# EAGLE design DressCode (EAGLE 6.4)
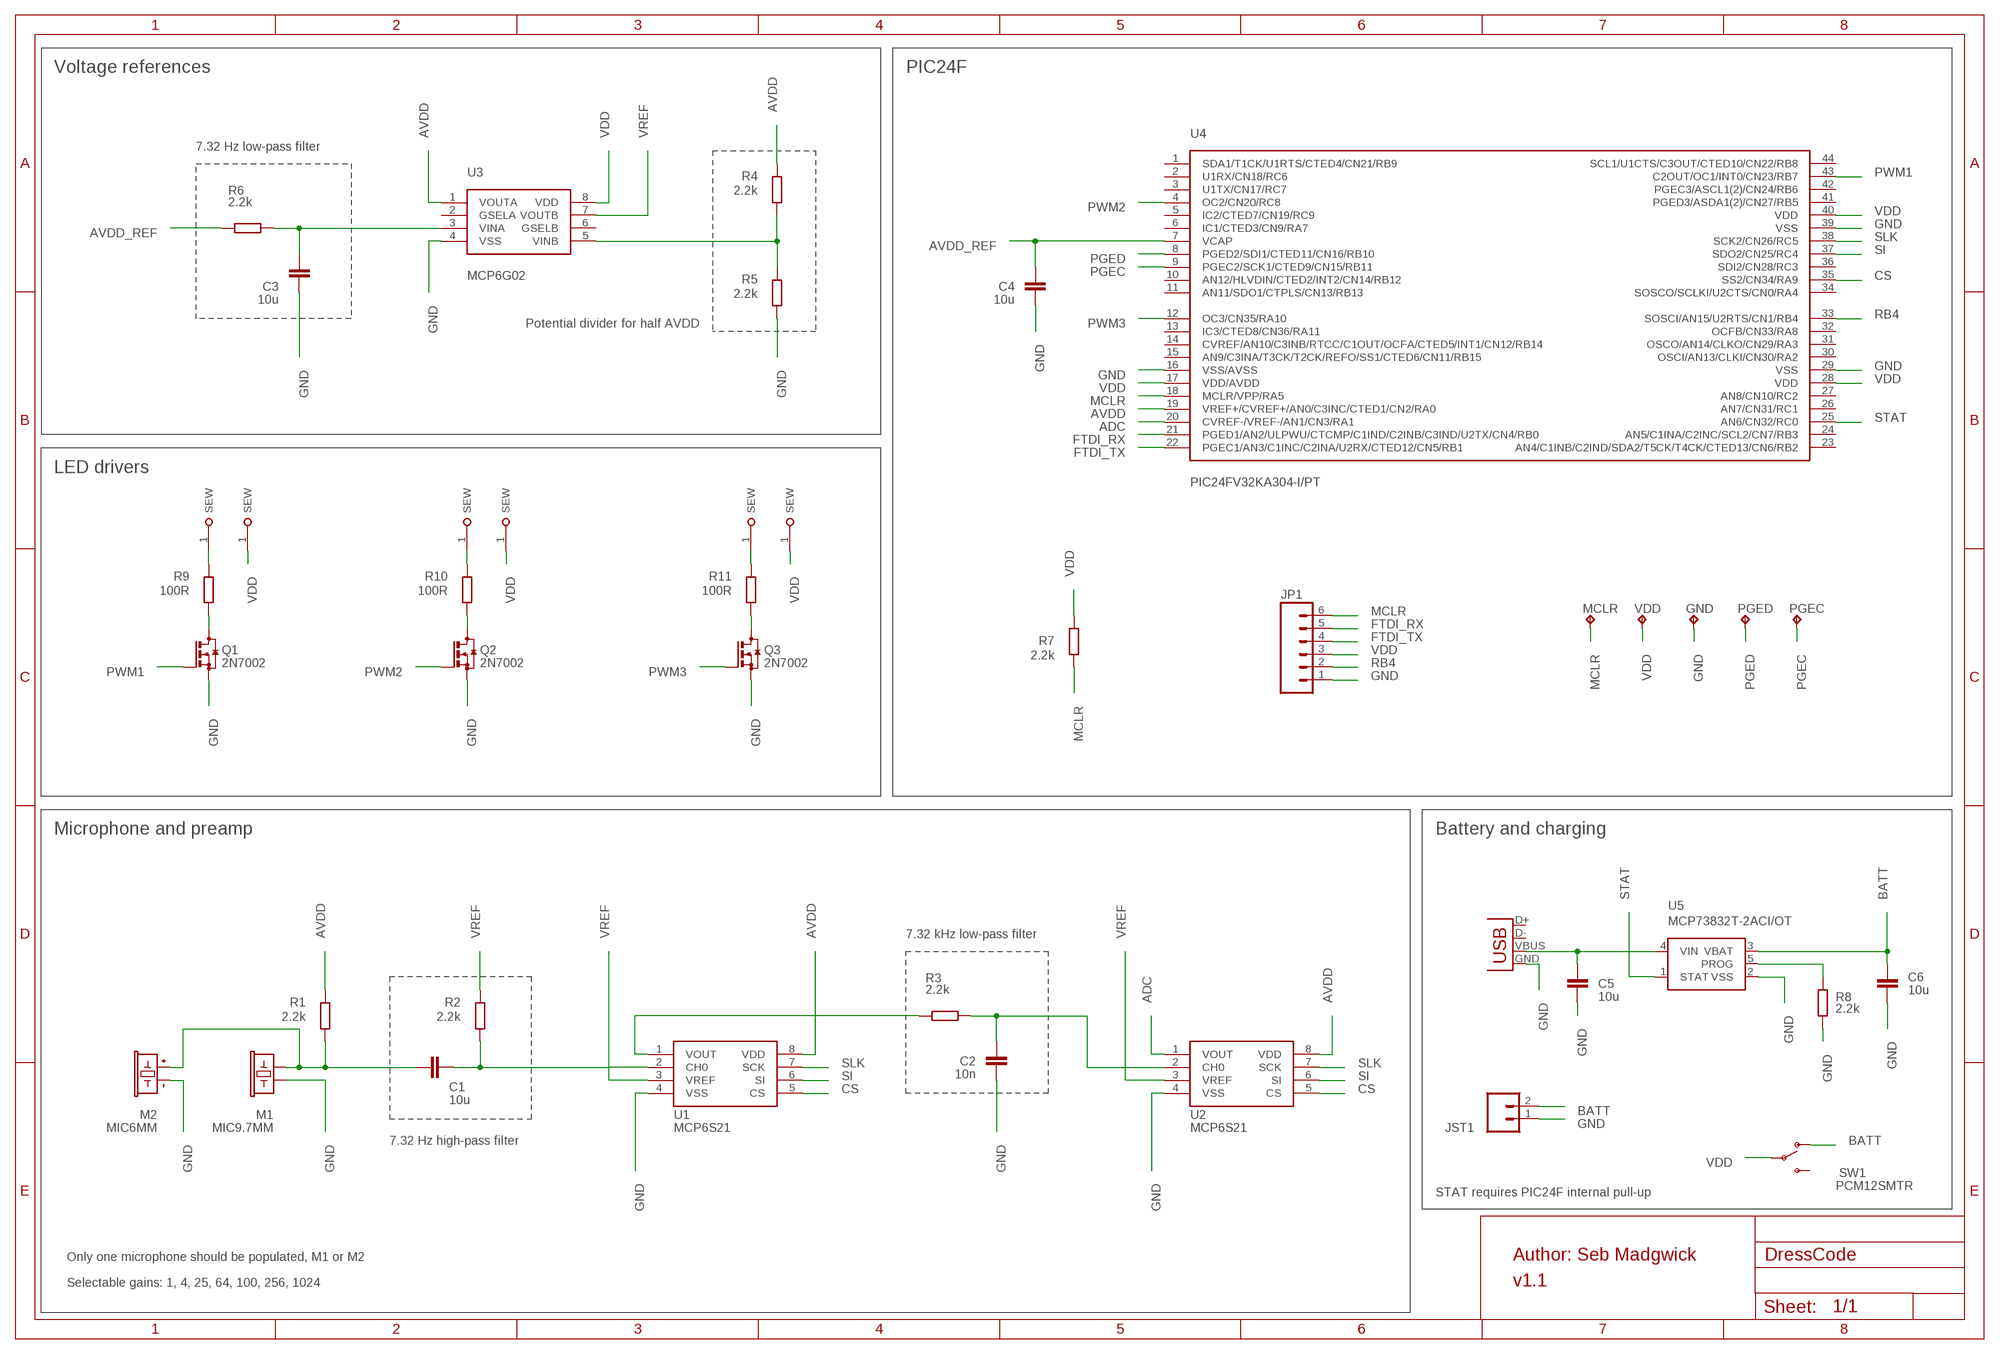
[diagram p0: schematic, sheet 1]

## Parts
C1  10u  C-EUC0805  [C0805]
C2  10n  C-EUC0805  [C0805]
C3  10u  C-EUC0805  [C0805]
C4  10u  C-EUC0805  [C0805]
C5  10u  C-EUC0805  [C0805]
C6  10u  C-EUC0805  [C0805]
GND  TPTP16R  [TP16R]
JP1  M06SIP  [1X06]
JST1  M02-JST-2MM-SMT  [JST-2-SMD]
M1  MIC9.7MM  [MIC-9.7MM]
M2  MIC6MM  [MIC-SMD]
MCLR  TPTP16R  [TP16R]
PGEC  TPTP16R  [TP16R]
PGED  TPTP16R  [TP16R]
Q1  2N7002  BSS123  [SOT23]
Q2  2N7002  BSS123  [SOT23]
Q3  2N7002  BSS123  [SOT23]
R1  2.2k  R-EU_R0805  [R0805]
R2  2.2k  R-EU_R0805  [R0805]
R3  2.2k  R-EU_R0805  [R0805]
R4  2.2k  R-EU_R0805  [R0805]
R5  2.2k  R-EU_R0805  [R0805]
R6  2.2k  R-EU_R0805  [R0805]
R7  2.2k  R-EU_R0805  [R0805]
R8  2.2k  R-EU_R0805  [R0805]
R9  100R  R-EU_R0805  [R0805]
R10  100R  R-EU_R0805  [R0805]
R11  100R  R-EU_R0805  [R0805]
SW1  PCM12SMTR  [PCM12SMTR]
U1  MCP6S21  [SOIC-8]
U2  MCP6S21  [SOIC-8]
U3  MCP6G02  [SOIC-8]
U4  PIC24FV32KA304-I/PT  [TQFP44]
U5  MCP73832T-2ACI/OT  MCP73831  [SOT23-5]
U$4  DRESSCODE_SEW_PADC  [DRESSCODE_SEW_PAD_CIRC]
U$5  DRESSCODE_SEW_PADC  [DRESSCODE_SEW_PAD_CIRC]
U$6  DRESSCODE_SEW_PADC  [DRESSCODE_SEW_PAD_CIRC]
U$7  DRESSCODE_SEW_PADS  [DRESSCODE_SEW_PAD_SQR]
U$8  DRESSCODE_SEW_PADS  [DRESSCODE_SEW_PAD_SQR]
U$10  DRESSCODE_SEW_PADS  [DRESSCODE_SEW_PAD_SQR]
USB1  USB-MICROB  [USB-MICROB]
VDD  TPTP16R  [TP16R]

## Nets
ADC: U2.1(VOUT) U4.20(CVREF-/VREF-/AN1/CN3/RA1)
AVDD: R1.2 R4.2 U1.8(VDD) U2.8(VDD) U3.1(VOUTA) U4.19(VREF+/CVREF+/AN0/C3INC/CTED1/CN2/RA0)
AVDD_REF: C4.2 R6.1 U4.7(VCAP)
BATT: C6.2 JST1.2 SW1.1(O) U5.3(VBAT)
CS: U1.5(CS) U2.5(CS) U4.35(SS2/CN34/RA9)
FTDI_RX: JP1.5 U4.21(PGED1/AN2/ULPWU/CTCMP/C1IND/C2INB/C3IND/U2TX/CN4/RB0)
FTDI_TX: JP1.4 U4.22(PGEC1/AN3/C1INC/C2INA/U2RX/CTED12/CN5/RB1)
GND: C2.2 C3.1 C4.1 C5.1 C6.1 GND.TP JP1.1 JST1.1 M1.2 M2.- Q1.2(S) Q2.2(S) Q3.2(S) R5.1 R8.1 U1.4(VSS) U2.4(VSS) U3.4(VSS) U4.16(VSS/AVSS) U4.29(VSS) U4.39(VSS) U5.2(VSS) USB1.GND
MCLR: JP1.6 MCLR.TP R7.1 U4.18(MCLR/VPP/RA5)
N$1: C1.1 M1.1 M2.+ R1.1
N$2: C1.2 R2.1 U1.2(CH0)
N$3: C2.1 R3.2 U2.2(CH0)
N$4: R3.1 U1.1(VOUT)
N$5: C3.2 R6.2 U3.3(VINA)
N$6: R4.1 R5.2 U3.5(VINB)
N$9: Q1.3(D) R9.1
N$10: Q2.3(D) R10.1
N$11: Q3.3(D) R11.1
N$12: R9.2 U$7.1(SEW)
N$13: R10.2 U$8.1(SEW)
N$14: R11.2 U$10.1(SEW)
N$15: R8.2 U5.5(PROG)
PGEC: PGEC.TP U4.9(PGEC2/SCK1/CTED9/CN15/RB11)
PGED: PGED.TP U4.8(PGED2/SDI1/CTED11/CN16/RB10)
PWM1: Q1.1(G) U4.43(C2OUT/OC1/INT0/CN23/RB7)
PWM2: Q2.1(G) U4.4(OC2/CN20/RC8)
PWM3: Q3.1(G) U4.12(OC3/CN35/RA10)
RB4: JP1.2 U4.33(SOSCI/AN15/U2RTS/CN1/RB4)
SI: U1.6(SI) U2.6(SI) U4.37(SDO2/CN25/RC4)
SLK: U1.7(SCK) U2.7(SCK) U4.38(SCK2/CN26/RC5)
STAT: U4.25(AN6/CN32/RC0) U5.1(STAT)
USB1: C5.2 U5.4(VIN) USB1.VBUS
VDD: JP1.3 R7.2 SW1.2(P) U3.8(VDD) U4.17(VDD/AVDD) U4.28(VDD) U4.40(VDD) U$4.1(SEW) U$5.1(SEW) U$6.1(SEW) VDD.TP
VREF: R2.2 U1.3(VREF) U2.3(VREF) U3.7(VOUTB)
Unconnected: SW1.3(S) U3.2(GSELA) U3.6(GSELB) U4.1(SDA1/T1CK/U1RTS/CTED4/CN21/RB9) U4.2(U1RX/CN18/RC6) U4.3(U1TX/CN17/RC7) U4.5(IC2/CTED7/CN19/RC9) U4.6(IC1/CTED3/CN9/RA7) U4.10(AN12/HLVDIN/CTED2/INT2/CN14/RB12) U4.11(AN11/SDO1/CTPLS/CN13/RB13) U4.13(IC3/CTED8/CN36/RA11) U4.14(CVREF/AN10/C3INB/RTCC/C1OUT/OCFA/CTED5/INT1/CN12/RB14) U4.15(AN9/C3INA/T3CK/T2CK/REFO/SS1/CTED6/CN11/RB15) U4.23(AN4/C1INB/C2IND/SDA2/T5CK/T4CK/CTED13/CN6/RB2) U4.24(AN5/C1INA/C2INC/SCL2/CN7/RB3) U4.26(AN7/CN31/RC1) U4.27(AN8/CN10/RC2) U4.30(OSCI/AN13/CLKI/CN30/RA2) U4.31(OSCO/AN14/CLKO/CN29/RA3) U4.32(OCFB/CN33/RA8) U4.34(SOSCO/SCLKI/U2CTS/CN0/RA4) U4.36(SDI2/CN28/RC3) U4.41(PGED3/ASDA1(2)/CN27/RB5) U4.42(PGEC3/ASCL1(2)/CN24/RB6) U4.44(SCL1/U1CTS/C3OUT/CTED10/CN22/RB8) USB1.D+ USB1.D-

## Notes on the sheet
- Voltage references | PIC24F
- 7.32 Hz low-pass filter
- Potential divider for half AVDD
- LED drivers
- Microphone and preamp | Battery and charging
- 7.32 kHz low-pass filter
- 7.32 Hz high-pass filter
- STAT requires PIC24F internal pull-up
- Only one microphone should be populated, M1 or M2 | Author: Seb Madgwick
- Selectable gains: 1, 4, 25, 64, 100, 256, 1024 | v1.1

## Library data of the parts
C1-C6 = rcl:C-EU: CAPACITOR, European symbol
GND MCLR PGEC PGED VDD = testpad:TP: Test pad
JP1 = SparkFun:M06: Header 6 Standard 6-pin 0.1" header. Use with straight break away headers (SKU : PRT-00116), right angle break away headers (PRT-00553), swiss pins (PRT-00743), machine pins (PRT-00117), and female headers (PRT-00115). Molex polarized connector foot print use with SKU : PRT-08094 with associated crimp pins and housings. NOTES ON THE VARIANTS LOCK and LOCK_LONGPADS... This footprint was designed to help hold the alignment of a through-hole component (i.e. 6-pin header) while soldering it into place. You may notice that each hole has been shifted either up or down by 0.005 of an inch from it's more standard position (which is a perfectly straight line). This slight alteration caused the pins (the squares in the middle) to touch the edges of the holes. Because they are alternating, it causes a "brace" to hold the component in place. 0.005 has proven to be the perfect amount of "off-center" position when using our standard breakaway headers. Although looks a little odd when you look at the bare footprint, once you have a header in there, the alteration is very hard to notice. Also, if you push a header all the way into place, it is covered up entirely on the bottom side. This idea of altering the position of holes to aid alignment will be further integrated into the Sparkfun Library for other footprints. It can help hold any component with 3 or more connection pins.
JST1 = SparkFun_08_2011:M02: Header 2 Standard 2-pin 0.1" header. Use with straight break away headers (SKU : PRT-00116), right angle break away headers (PRT-00553), swiss pins (PRT-00743), machine pins (PRT-00117), and female headers (PRT-00115). Molex polarized connector foot print use with SKU : PRT-08233 with associated crimp pins and housings.
M1 = SparkFun:MIC: Microphone Omni-directional electret microphone. 9.7mm standard diameter.
M2 = x-io:MIC: Microphone Omni-directional electret microphone. 9.7mm standard diameter.
Q1-Q3 = transistor-small-signal:BSS123: N-CHANNEL MOS FET
R1-R11 = rcl:R-EU_: RESISTOR, European symbol
SW1 = SparkFun0modified:PCM12SMTR
U1 U2 = x-io:MCP6S21
U3 = x-io:MCP6G02
U4 = x-io:PIC24FV32KA304
U5 = SparkFun_08_2011:MCP73831: Microchip's MCP73831 Miniature single cell, fully integrated Li-Ion, Li-polymer charge management controller http://ww1.microchip.com/downloads/en/DeviceDoc/21984a.pdf
U$4-U$8 U$10 = x-io:DRESSCODE_SEW_PAD
USB1 = SparkFun_08_2011:USB: USB Connectors USB-B-PTH is fully proven SKU : PRT-00139 USB-miniB is fully proven SKU : PRT-00587 USB-A-PCB is untested. USB-A-H is throughly reviewed, but untested. Spark Fun Electronics SKU : PRT-00437 USB-B-SMT is throughly reviewed, but untested. Needs silkscreen touching up. USB-A-S has not been used/tested USB-MB-H has not been used/tested

## Board
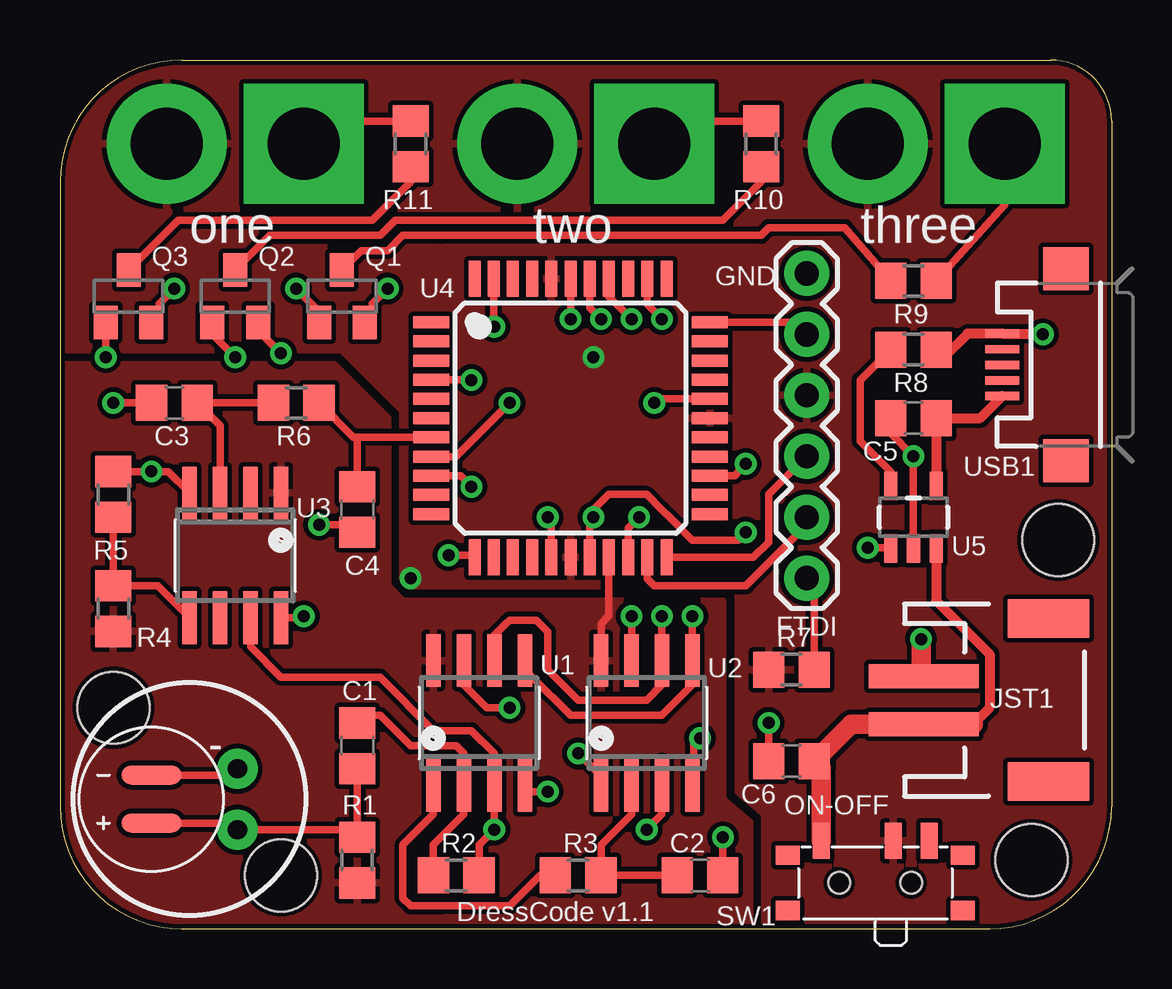
[diagram p1: board, top side]
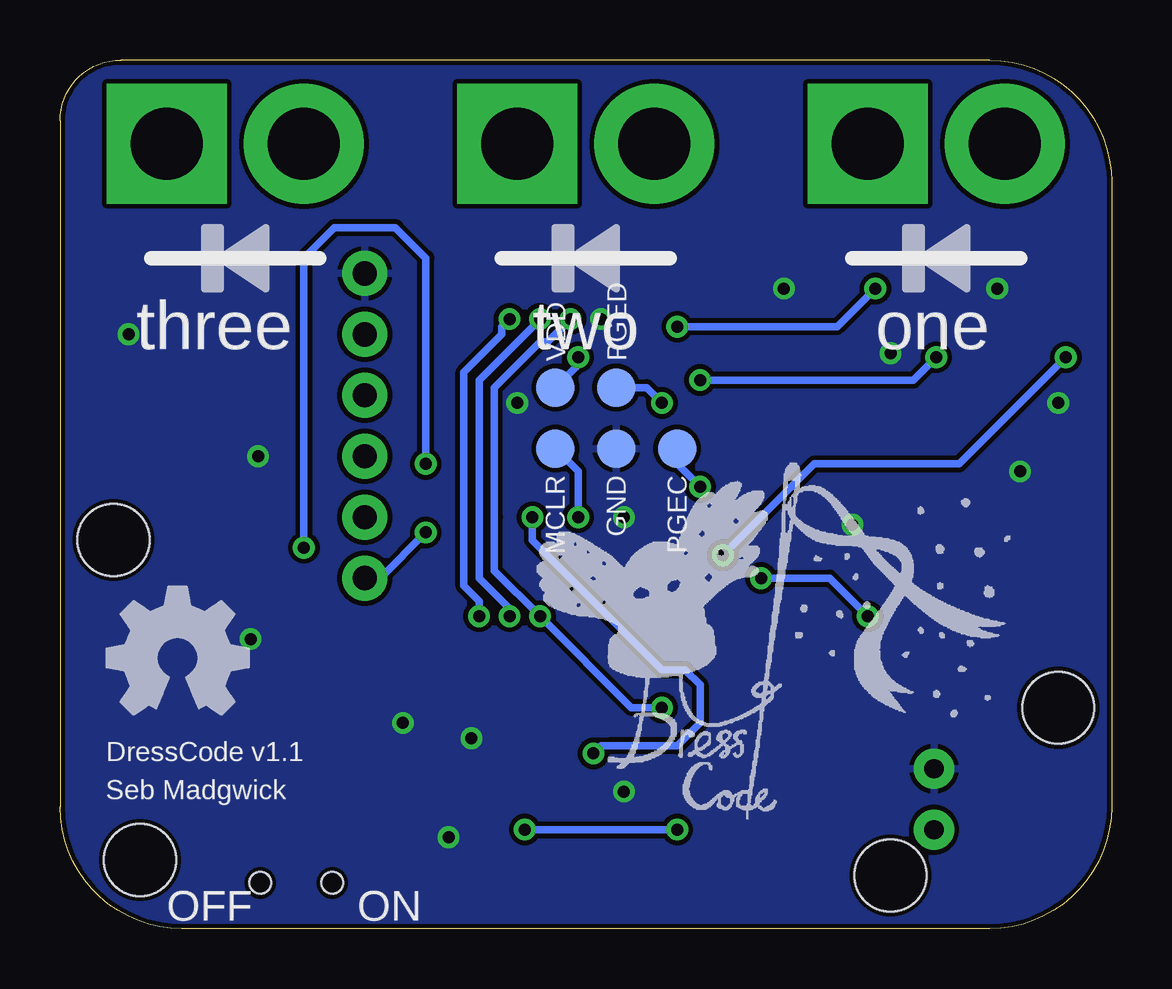
[diagram p2: board, bottom side, seen from below]

Size 43.81 x 36.2 mm. Coordinates in mm from the lower left corner, seen from the top.
Outline: 5.08,0 38.73,0 arc90 43.81,5.08 43.81,33.66 arc90 41.27,36.2 5.08,36.2 arc90 0,31.11 0,5.08 arc90 5.08,0
Copper layers (1*16): Top 0.035mm / dielectric 1.5mm / Bottom 0.035mm
Design rules "default *": minimum track width 0.2mm, minimum drill 0.5mm, track to track 0.2mm, track to pad 0.2mm, pad to pad 0.2mm, via to via 0.2mm, smd to smd 0.2mm, copper to edge 0.2mm, drill to drill 0.3mm, minimum pad ring 10mil, minimum via ring 8mil, stop-mask expansion 4mil, vias tented up to drill 1mm, thermal gap 0.2mm
Holes 3 mm at 2.22,9.21 9.21,2.22 40.48,2.86 41.59,16.19

### Footprints (pad centres in the part's own frame; a part is rotated, then mirrored left to right if it is on the bottom)
C0805 = smd 1.3 x 1.5: 1 -0.95,0; 2 0.95,0
TP16R = smd 1.6 x 1.6: TP 0,0
1X06 = drill 1.016 pad 1.88: 1 0,0; 2 2.54,0; 3 5.08,0; 4 7.62,0; 5 10.16,0; 6 12.7,0
JST-2-SMD = smd 1 x 4.6: 1 -1,-3.7; 2 1,-3.7 | smd 1.6 x 3.4: NC1 -3.4,1.5; NC2 3.4,1.5
MIC-9.7MM = drill 0.8 pad 1.676: 1 -2,1.27; 2 -2,-1.27
MIC-SMD = smd 2.5 x 0.8: + 0,-1; - 0,1
SOT23 = smd 1 x 1.4: 1 -0.95,-1.1; 2 0.95,-1.1; 3 0,1.1
R0805 = smd 1.3 x 1.5: 1 -0.95,0; 2 0.95,0
PCM12SMTR = smd 0.7 x 1.5: 1 -2.25,1.75; 2 0.75,1.75; 3 2.25,1.75 | smd 1 x 0.8: A -3.65,-1.15; B -3.65,1.15; C 3.65,1.15; D 3.65,-1.15 | hole 0.9: 1.5,0; -1.5,0
SOIC-8 = smd 0.6 x 2.2: 1 -1.905,-2.6; 2 -0.635,-2.6; 3 0.635,-2.6; 4 1.905,-2.6; 5 1.905,2.6; 6 0.635,2.6; 7 -0.635,2.6; 8 -1.905,2.6
TQFP44 = smd 1.5 x 0.5: 1 -5.8,4; 2 -5.8,3.2; 3 -5.8,2.4; 4 -5.8,1.6; 5 -5.8,0.8; 6 -5.8,0; 7 -5.8,-0.8; 8 -5.8,-1.6; 9 -5.8,-2.4; 10 -5.8,-3.2; 11 -5.8,-4; 23 5.8,-4; 24 5.8,-3.2; 25 5.8,-2.4; 26 5.8,-1.6; 27 5.8,-0.8; 28 5.8,0; 29 5.8,0.8; 30 5.8,1.6; 31 5.8,2.4; 32 5.8,3.2; 33 5.8,4 | smd 0.5 x 1.5: 12 -4,-5.8; 13 -3.2,-5.8; 14 -2.4,-5.8; 15 -1.6,-5.8; 16 -0.8,-5.8; 17 0,-5.8; 18 0.8,-5.8; 19 1.6,-5.8; 20 2.4,-5.8; 21 3.2,-5.8; 22 4,-5.8; 34 4,5.8; 35 3.2,5.8; 36 2.4,5.8; 37 1.6,5.8; 38 0.8,5.8; 39 0,5.8; 40 -0.8,5.8; 41 -1.6,5.8; 42 -2.4,5.8; 43 -3.2,5.8; 44 -4,5.8
SOT23-5 = smd 0.55 x 1.2: 1 -0.95,-1.3; 2 0,-1.3; 3 0.95,-1.3; 4 0.95,1.3; 5 -0.95,1.3
DRESSCODE_SEW_PAD_CIRC = drill 3 pad 5: 1 0,0
DRESSCODE_SEW_PAD_SQR = drill 3 pad 5 square: 1 0,0
USB-MICROB = smd 0.35 x 1.4: D+ 0,2.65; D- -0.65,2.65; GND 1.3,2.65; ID 0.65,2.65; VBUS -1.3,2.65 | smd 1.8 x 1.9: MT1 -4,0; MT2 4,0

### Placement (x,y rotation side)
C1  12.38,7.62 90 top
C2  26.67,2.22 0 top
C3  4.76,21.91 0 top
C4  12.38,17.46 90 top
C5  35.56,21.27 0 top
C6  30.48,6.99 0 top
GND  20.64,20 90 bottom
JP1  31.11,27.3 270 top
JST1  39.69,9.53 270 top
M1  5.4,5.4 180 top
M2  3.81,5.4 0 top
MCLR  23.18,20 90 bottom
PGEC  18.1,20 90 bottom
PGED  20.64,22.54 90 bottom
Q1  11.75,26.35 0 top
Q2  7.3,26.35 0 top
Q3  2.86,26.35 0 top
R1  12.38,2.86 270 top
R2  16.51,2.22 0 top
R3  21.59,2.22 0 top
R4  2.22,13.34 270 top
R5  2.22,18.1 270 top
R6  9.84,21.91 180 top
R7  30.48,10.79 180 top
R8  35.56,24.13 180 top
R9  35.56,26.99 0 top
R10  29.21,32.7 90 top
R11  14.61,32.7 90 top
SW1  33.97,1.91 0 top
U1  17.46,8.57 0 top
U2  24.45,8.57 0 top
U3  7.3,15.56 180 top
U4  21.27,21.27 0 top
U5  35.56,17.14 0 top
U$1  [OSHW_LOGO_6MM_BOTTOM]  41.91,8.89 0 bottom
U$4  33.66,32.7 0 top
U$5  4.45,32.7 90 top
U$6  19.05,32.7 90 top
U$7  39.37,32.7 0 top
U$8  24.77,32.7 0 top
U$9  [DRESSCODE_LOGO]  3.67,4.35 0 top
U$10  10.16,32.7 0 top
USB1  41.91,23.5 90 top
VDD  23.18,22.54 90 bottom

### Tracks (layer width: path | path; a pad name or v marks a point on that pad's centre or on a via)
ADC  (via drill 0.5)
  Top 0.305: U4.20 23.67,16.69 v24.13,17.14 | U2.1 22.54,6.35 v21.59,7.3
  Bottom 0.305: v24.13,17.14 24.13,16.19 18.73,10.79 17.78,10.79 17.14,10.16 17.14,8.57 18.1,7.62 20.95,7.62 21.27,7.62 v21.59,7.3
AVDD
  Top 0.305: U4.19 22.87,13.03 22.54,12.7 U2.8
  pour Top: 0,0 28.73,0 28.73,4.45 27.62,5.4 27.62,13.65 14.29,13.65 13.65,14.29 13.65,21.27 11.43,23.5 0,23.5
AVDD_REF
  Top 0.305: U4.7 12.38,20.47 | 12.38,20.47 12.23,20.47 R6.1 | C4.2 12.38,20.47
BATT
  Top 0.406: U5.3 36.51,13.65 38.73,11.43 38.73,9.21 38.05,8.53
  Top 0.813: SW1.1 31.72,6.69 C6.2 32.97,8.53 JST1.2 38.05,8.53
CS  (via drill 0.5)
  Top 0.305: U4.35 24.47,26.01 v25.08,25.4 | v26.35,13.02 U2.5 26.35,10.16 25.08,8.89 21.27,8.89 19.68,10.48 19.37,10.79 U1.5
  Bottom 0.305: v26.35,13.02 26.35,13.65 26.99,14.29 26.99,23.18 25.4,24.77 25.4,25.08 v25.08,25.4
FTDI_RX
  Top 0.305: U4.21 24.47,14.58 24.77,14.29 28.26,14.29 28.57,14.29 30.8,16.51 30.8,16.83 JP1.5
FTDI_TX
  Top 0.305: JP1.4 29.53,18.1 29.53,16.51 29.53,16.11 28.89,15.47 U4.22
GND  (via drill 0.5)
  Top 0.305: C3.1 v2.22,21.91 | U4.39 v21.27,25.4 | U4.16 20.47,16.99 v20.32,17.14 | 26.41,6.03 U2.4 26.41,6.03 | Q3.2 4.13,25.57 4.13,26.04 v4.76,26.67 | Q2.2 8.57,25.57 8.57,24.61 v9.21,23.97 | Q1.2 13.02,25.57 13.02,26.04 v13.65,26.67 | v20.32,5.71 19.62,5.71 U1.4 | v27.62,3.81 27.62,2.86 C2.2 | M2.- 7.13,6.4 M1.2 | C4.1 12.07,16.83 v10.79,16.83 | U3.4 4.51,19.05 | 4.51,19.05 R5.1 | U4.29 24.93,22.07 arc90 v24.77,21.91 | 29.84,6.99 C6.1 v29.53,8.57 | 4.51,19.05 v3.81,19.05 | 26.41,6.03 26.41,7.68 v26.67,7.94 | U5.2 35.56,19.37 v35.56,19.68 34.61,20.64 C5.1
  Top 0.406: v40.96,24.77 40.96,24.8 USB1.GND 37.81,24.8 36.83,23.81 R8.1
  Top 0.813: v35.88,12.06 35.88,10.63 JST1.1
  pour Bottom: 0,0 43.81,0 43.81,36.2 0,36.2
MCLR  (via drill 0.5)
  Top 0.305: U4.18 22.07,16.98 v22.23,17.14 22.23,17.46 22.86,18.1 24.45,18.1 25.08,17.46 25.4,17.14 26.35,16.19 28.26,16.19 v28.57,16.51 | R7.1 31.43,14.29 JP1.6
  Bottom 0.305: v22.23,17.14 22.23,19.05 MCLR.TP | v28.57,16.51 30.48,14.61 JP1.6
N$1
  Top 0.305: C1.1 R1.1 12.06,4.13 M1.1 7.13,4.4 M2.+
N$2
  Top 0.305: 15.88,2.54 R2.1 15.56,3.49 16.83,4.76 U1.2 16.83,7.3 16.51,7.62 14.61,7.62 13.34,8.89 12.7,8.89 C1.2
N$3
  Top 0.305: C2.1 R3.2 22.54,3.49 23.81,4.76 U2.2
N$4
  Top 0.305: R3.1 20,2.22 18.73,0.95 15.88,0.95 14.61,0.95 14.29,1.27 14.29,3.49 15.56,4.76 U1.1
N$5
  Top 0.305: U3.3 6.67,20.95 C3.2 R6.2
N$6
  Top 0.305: R5.2 R4.1 4.07,14.29 U3.5
N$9
  Top 0.305: R9.1 32.7,29.21 29.53,29.21 29.21,28.89 15.88,28.89 14.29,28.89 13.65,28.26 12.55,28.26 Q1.3
N$10
  Top 0.305: Q2.3 8.74,28.89 13.34,28.89 13.97,29.53 27.62,29.53 29.21,31.11 R10.1
N$11
  Top 0.305: Q3.3 4.93,29.53 13.02,29.53 14.61,31.11 R11.1
N$12
  Top 0.305: U$7.1 39.37,30.16 R9.2
N$13
  Top 0.305: R10.2 25.71,33.65 U$8.1
N$14
  Top 0.305: R11.2 11.11,33.65 U$10.1
N$15
  Top 0.305: U5.5 34.61,19.05 33.34,20.32 33.34,22.86 R8.2
PGEC  (via drill 0.5)
  Top 0.305: U4.9 16.69,18.87 v17.14,18.41
  Bottom 0.305: v17.14,18.41 18.1,19.37 PGEC.TP
PGED  (via drill 0.5)
  Top 0.305: U4.8 16.5,19.67 v18.73,21.91
  Bottom 0.305: PGED.TP 19.37,22.54 v18.73,21.91
PWM1  (via drill 0.5)
  Top 0.305: Q1.1 10.8,25.71 v9.84,26.67 | v18.1,25.08 18.07,25.11 U4.43
  Bottom 0.305: v9.84,26.67 11.43,25.08 v18.1,25.08
PWM2  (via drill 0.5)
  Top 0.305: v17.14,22.86 17.13,22.87 U4.4 | Q2.1 6.35,24.77 v7.3,23.81
  Bottom 0.305: v17.14,22.86 9.84,22.86 8.26,22.86 v7.3,23.81
PWM3  (via drill 0.5)
  Top 0.305: Q3.1 v1.91,23.81 | v16.19,15.56 17.19,15.56 U4.12
  Bottom 0.305: v16.19,15.56 12.38,19.37 6.35,19.37 v1.91,23.81
RB4
  Top 0.305: U4.33 30.61,25.27 JP1.2
SI  (via drill 0.5)
  Top 0.305: U4.37 22.87,26.34 23.5,25.72 v23.81,25.4 | v25.08,13.02 U2.6 25.08,10.16 24.45,9.53 21.59,9.53 20.32,10.79 20.32,12.38 19.84,12.86 18.73,12.86 18.57,12.7 18.1,12.22 U1.6
  Bottom 0.305: v25.08,13.02 25.08,13.34 26.35,14.61 26.35,15.24 26.35,22.86 v23.81,25.4
SLK  (via drill 0.5)
  Top 0.305: U4.38 22.07,25.87 v22.54,25.4 | U2.7 v23.81,13.02 | v18.73,9.21 17.78,9.21 16.83,10.16 U1.7
  Bottom 0.305: v22.54,25.4 23.5,24.45 23.81,24.45 25.72,22.54 25.72,17.14 25.72,14.92 v23.81,13.02 20,9.21 v18.73,9.21
STAT  (via drill 0.5)
  Top 0.305: U4.25 28.12,18.87 v28.57,19.37 | v33.66,15.88 34.58,15.88 U5.1
  Bottom 0.305: v28.57,19.37 28.57,27.94 29.84,29.21 32.38,29.21 33.66,27.94 v33.66,15.88
USB1
  Top 0.406: U5.4 C5.2 38.34,21.27 USB1.VBUS
VDD  (via drill 0.5)
  Top 0.305: U3.8 10.1,12.96 v10.16,13.02
  Bottom 0.305: v14.61,14.61 11.75,14.61 v10.16,13.02 | v22.23,23.81 22.23,23.5 VDD.TP
  pour Top: 43.81,0 29.37,0 29.37,4.76 28.26,5.71 28.26,14.29 14.61,14.29 14.29,14.61 14.29,21.59 11.75,24.13 0,24.13 0,36.2 43.81,36.2
VREF  (via drill 0.5)
  Top 0.305: 25.08,6.99 U2.3 25.08,4.76 v24.45,4.13 | U3.7 7.94,11.75 9.21,10.48 13.34,10.48 15.56,8.26 17.14,8.26 18.1,7.3 U1.3 v18.1,4.13 17.46,3.49 17.46,3.17 R2.2
  Bottom 0.305: v24.45,4.13 v18.1,4.13

### Text on the board
_tsilk: one | two | three | GND | FTDI | ON-OFF | DressCode v1.1
_bsilk: one | two | three | DressCode v1.1 | Seb Madgwick | ON | OFF